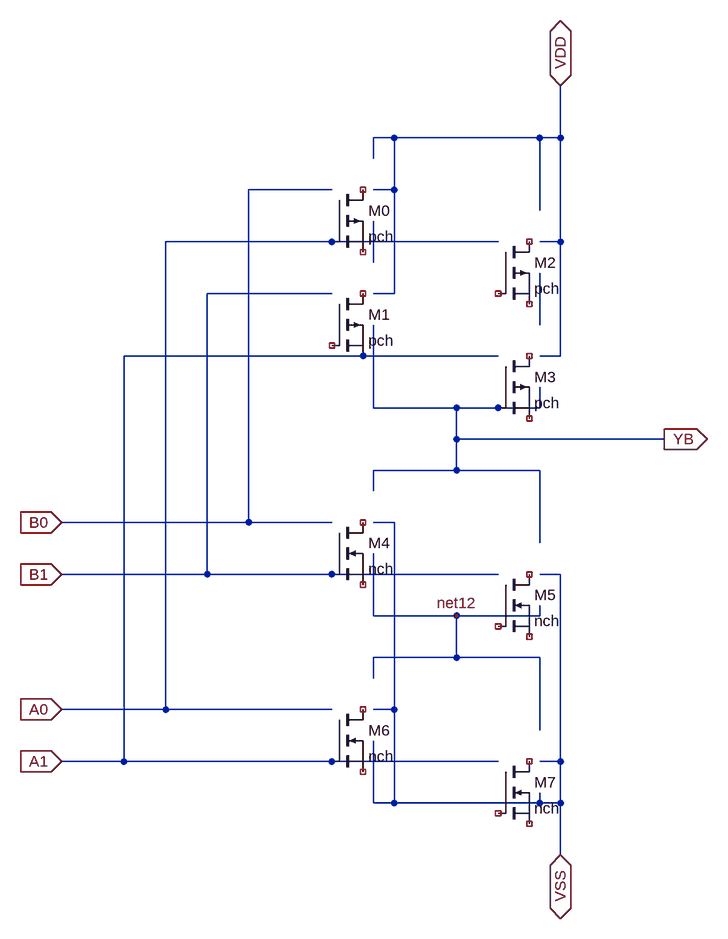
[diagram p0: schematic na222.asc]
na222.asc, the LTspice schematic file:
Version 4
SHEET 1 1104 1376
WIRE 864 96 864 176
WIRE 864 512 864 336
WIRE 832 512 864 512
WIRE 832 176 864 176
WIRE 864 336 864 176
WIRE 832 336 864 336
WIRE 608 416 608 256
WIRE 576 416 608 416
WIRE 608 256 608 176
WIRE 608 176 832 176
WIRE 576 256 608 256
WIRE 832 288 832 176
WIRE 576 176 608 176
WIRE 576 208 576 176
WIRE 576 368 576 304
WIRE 320 848 768 848
WIRE 320 416 512 416
WIRE 320 848 320 416
WIRE 96 848 320 848
WIRE 704 640 1024 640
WIRE 704 640 704 592
WIRE 704 688 704 640
WIRE 704 592 832 592
WIRE 704 688 832 688
WIRE 832 592 832 560
WIRE 576 592 704 592
WIRE 576 592 576 464
WIRE 832 800 832 688
WIRE 576 720 576 688
WIRE 576 688 704 688
WIRE 384 256 512 256
WIRE 384 768 384 256
WIRE 384 768 512 768
WIRE 96 768 384 768
WIRE 704 976 704 912
WIRE 704 912 832 912
WIRE 704 976 832 976
WIRE 576 912 576 816
WIRE 576 912 704 912
WIRE 832 912 832 896
WIRE 832 1088 832 976
WIRE 576 976 704 976
WIRE 576 1008 576 976
WIRE 864 1280 864 1200
WIRE 832 1136 864 1136
WIRE 832 1200 864 1200
WIRE 864 1200 864 1136
WIRE 832 848 864 848
WIRE 864 1136 864 848
WIRE 608 1056 608 768
WIRE 608 1200 608 1056
WIRE 608 1200 832 1200
WIRE 576 768 608 768
WIRE 832 1200 832 1184
WIRE 576 1200 608 1200
WIRE 576 1200 576 1104
WIRE 576 1056 608 1056
WIRE 832 464 832 384
WIRE 256 336 768 336
WIRE 256 1056 256 336
WIRE 256 1056 512 1056
WIRE 96 1056 256 1056
WIRE 192 512 768 512
WIRE 192 1136 192 512
WIRE 192 1136 768 1136
WIRE 96 1136 192 1136
FLAG 704 912 net12
SYMBOL NMOS 768 1136 R0
SYMATTR InstName M7
SYMATTR Value nch
SYMATTR Value2 w=2u l=1u
SYMBOL NMOS 512 1056 R0
SYMATTR InstName M6
SYMATTR Value nch
SYMATTR Value2 w=2u l=1u
SYMBOL NMOS 768 848 R0
SYMATTR InstName M5
SYMATTR Value nch
SYMATTR Value2 w=2u l=1u
SYMBOL NMOS 512 768 R0
SYMATTR InstName M4
SYMATTR Value nch
SYMATTR Value2 w=2u l=1u
SYMBOL PMOS 768 512 R0
SYMATTR InstName M3
SYMATTR Value pch
SYMATTR Value2 w=6u l=1u
SYMBOL PMOS 768 336 R0
SYMATTR InstName M2
SYMATTR Value pch
SYMATTR Value2 w=6u l=1u
SYMBOL PMOS 512 416 R0
SYMATTR InstName M1
SYMATTR Value pch
SYMATTR Value2 w=6u l=1u
SYMBOL PMOS 512 256 R0
SYMATTR InstName M0
SYMATTR Value pch
SYMATTR Value2 w=6u l=1u
FLAG 1024 640 YB
IOPIN 1024 640 Out
FLAG 864 1280 VSS
IOPIN 864 1280 BiDir
FLAG 864 96 VDD
IOPIN 864 96 BiDir
FLAG 96 848 B1
IOPIN 96 848 In
FLAG 96 768 B0
IOPIN 96 768 In
FLAG 96 1136 A1
IOPIN 96 1136 In
FLAG 96 1056 A0
IOPIN 96 1056 In

The netlist it stands for:
* na222.asc
* M7: nch w=2u l=1u (symbol NMOS not certain, pin order unknown); nets seen at it: 
* M6: nch w=2u l=1u (symbol NMOS not certain, pin order unknown); nets seen at it: A1
* M5: nch w=2u l=1u (symbol NMOS not certain, pin order unknown); nets seen at it: 
* M4: nch w=2u l=1u (symbol NMOS not certain, pin order unknown); nets seen at it: B1
* M3: pch w=6u l=1u (symbol PMOS not certain, pin order unknown); nets seen at it: YB
* M2: pch w=6u l=1u (symbol PMOS not certain, pin order unknown); nets seen at it: 
* M1: pch w=6u l=1u (symbol PMOS not certain, pin order unknown); nets seen at it: A1
* M0: pch w=6u l=1u (symbol PMOS not certain, pin order unknown); nets seen at it: A0
.backanno
.end